# EAGLE design LTP_M - ISP (EAGLE 4.16)
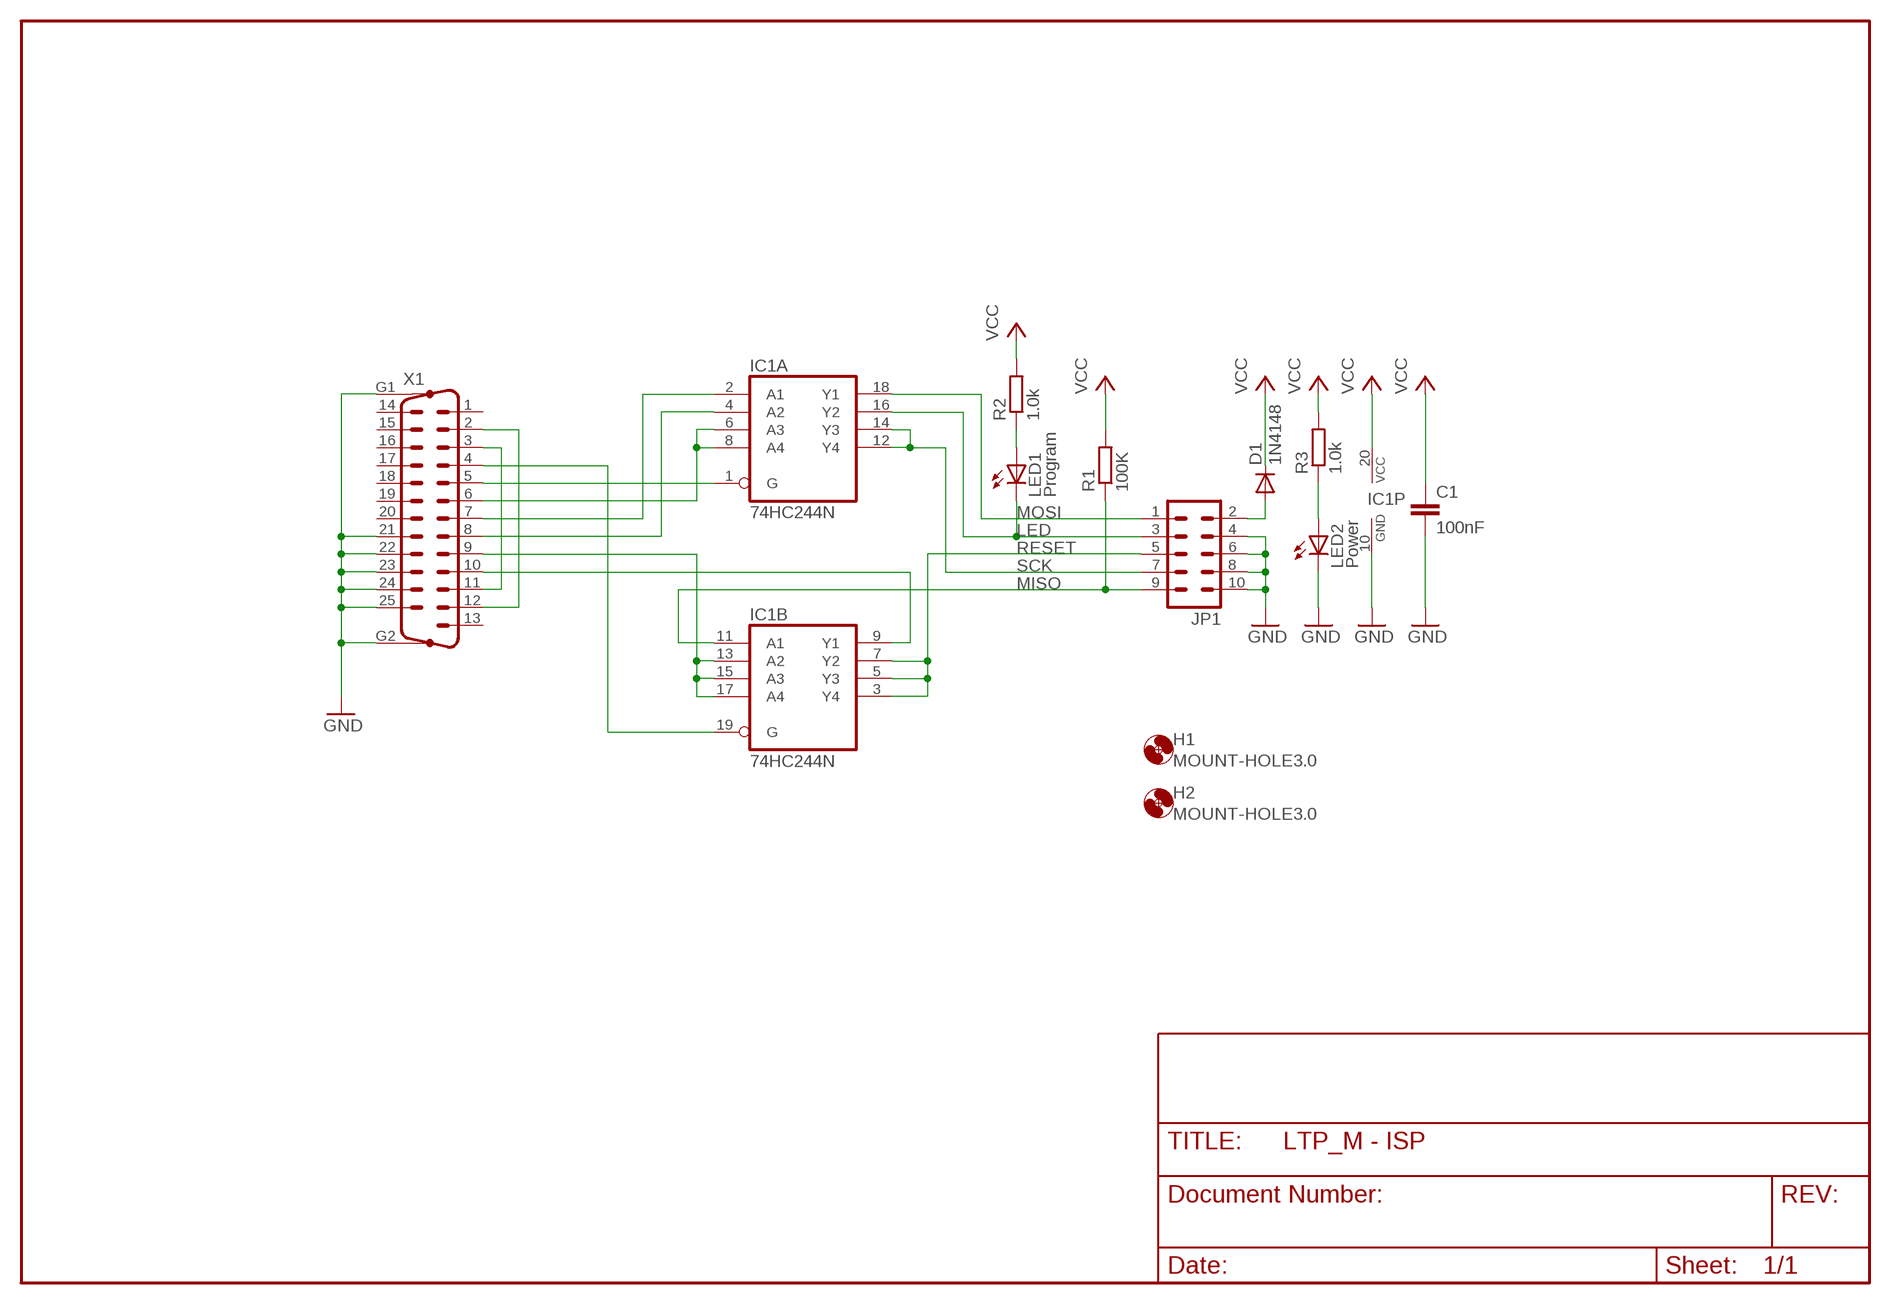
[diagram p0: schematic, sheet 1]

## Parts
C1  100nF  C-EU025-024X044  [C025-024X044]
D1  1N4148  BAS15  [DO34-7]
H1  MOUNT-HOLE3.0  [3,0]
H2  MOUNT-HOLE3.0  [3,0]
IC1  74HC244N  [DIL20]
JP1  ML10  [ML10]
LED1  Program  LED3MM  [LED3MM]
LED2  Power  LED3MM  [LED3MM]
R1  100K  R-EU_0207/7  [0207/7]
R2  1.0k  R-EU_0207/10  [0207/10]
R3  1.0k  R-EU_0207/10  [0207/10]
X1  M25HP  [M25HP]

## Nets
GND: C1.2 IC1.10(P:GND) JP1.4 JP1.6 JP1.8 JP1.10 LED2.K(C) X1.21 X1.22 X1.23 X1.24 X1.25 X1.G1 X1.G2
LED: IC1.16(A:Y2) JP1.3 LED1.K(C)
MISO: IC1.11(B:A1) JP1.9 R1.1
MOSI: IC1.18(A:Y1) JP1.1
N$1: IC1.1(A:G) X1.5
N$2: IC1.19(B:G) X1.4
N$3: X1.2 X1.12
N$4: IC1.2(A:A1) X1.7
N$5: IC1.4(A:A2) X1.8
N$6: IC1.6(A:A3) IC1.8(A:A4) X1.6
N$7: IC1.9(B:Y1) X1.10
N$8: IC1.13(B:A2) IC1.15(B:A3) IC1.17(B:A4) X1.9
N$9: X1.3 X1.11
N$10: LED1.A R2.1
N$11: LED2.A R3.1
RESET: IC1.3(B:Y4) IC1.5(B:Y3) IC1.7(B:Y2) JP1.5
SCK: IC1.12(A:Y4) IC1.14(A:Y3) JP1.7
VCC: C1.1 D1.C IC1.20(P:VCC) R1.2 R2.2 R3.2
VDD: D1.A JP1.2
Unconnected: X1.1 X1.13 X1.14 X1.15 X1.16 X1.17 X1.18 X1.19 X1.20

## Library data of the parts
C1 = rcl:C-EU: CAPACITOR, European symbol
D1 = diode:BAS15: DIODE high speed
H1 H2 = holes:MOUNT-HOLE: MOUNTING HOLE with drill center marker
IC1 = 74xx-eu:74*244: Octal BUFFER and LINE DRIVER, 3-state
JP1 = con-harting-ml:ML10: HARTING
LED1 LED2 = led:LED: LED OSRAM: - CHIPLED LG R971, LG N971, LY N971, LG Q971, LY Q971, LO R971, LY R971 LH N974, LH R974 LS Q976, LO Q976, LY Q976 LO Q996 - Hyper CHIPLED LW Q18S LB Q993, LB Q99A, LB R99A - SideLED LS A670, LO A670, LY A670, LG A670, LP A670 LB A673, LV A673, LT A673, LW A673 LH A674 LY A675 LS A676, LA A676, LO A676, LY A676, LW A676 LS A679, LY A679, LG A679 - Hyper Micro SIDELED® LS Y876, LA Y876, LO Y876, LY Y876 LT Y87S - SmartLED LW L88C, LW L88S LB L89C, LB L89S, LG L890 LS L89K, LO L89K, LY L89K LS L896, LA L896, LO L896, LY L896 - TOPLED LS T670, LO T670, LY T670, LG T670, LP T670 LSG T670, LSP T670, LSY T670, LOP T670, LYG T670 LG T671, LOG T671, LSG T671 LB T673, LV T673, LT T673, LW T673 LH T674 LS T676, LA T676, LO T676, LY T676, LB T676, LH T676, LSB T676, LW T676 LB T67C, LV T67C, LT T67C, LS T67K, LO T67K, LY T67K, LW E67C LS E67B, LA E67B, LO E67B, LY E67B, LB E67C, LV E67C, LT E67C LW T67C LS T679, LY T679, LG T679 LS T770, LO T770, LY T770, LG T770, LP T770 LB T773, LV T773, LT T773, LW T773 LH T774 LS E675, LA E675, LY E675, LS T675 LS T776, LA T776, LO T776, LY T776, LB T776 LHGB T686 LT T68C, LB T68C - Hyper Mini TOPLED® LB M676 - Mini TOPLED Santana® LG M470 LS M47K, LO M47K, LY M47K Source: http://www.osram.convergy.de/
R1-R3 = rcl:R-EU_: RESISTOR, European symbol
X1 = con-subd:M25HP: SUB-D

## Board
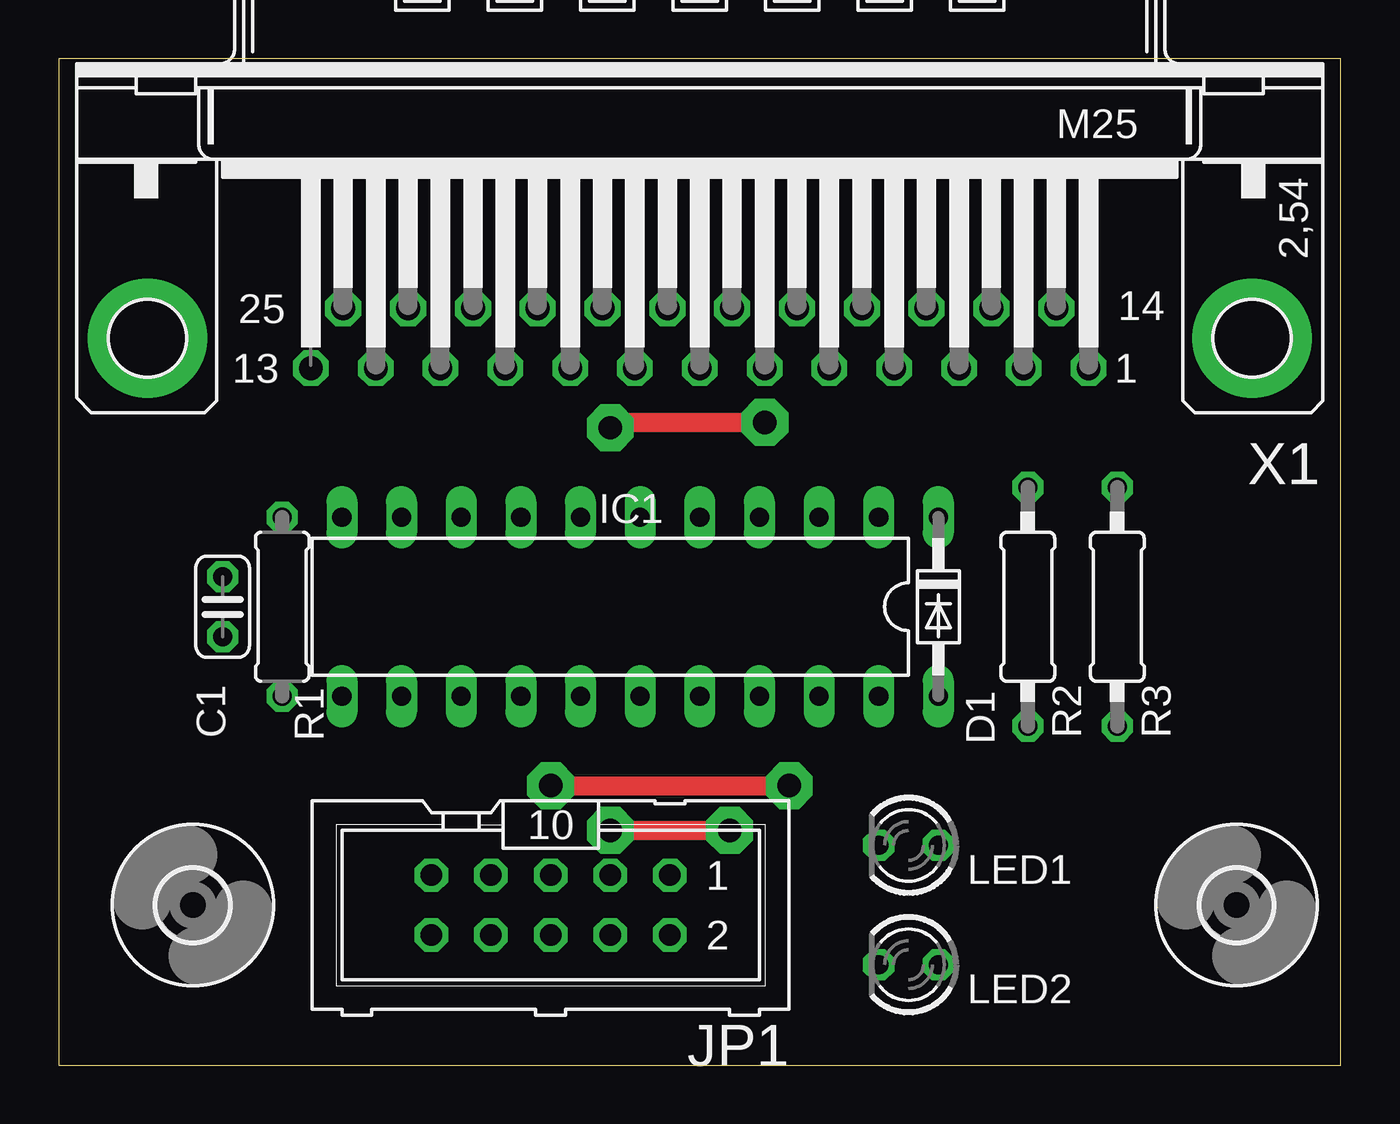
[diagram p1: board, top side]
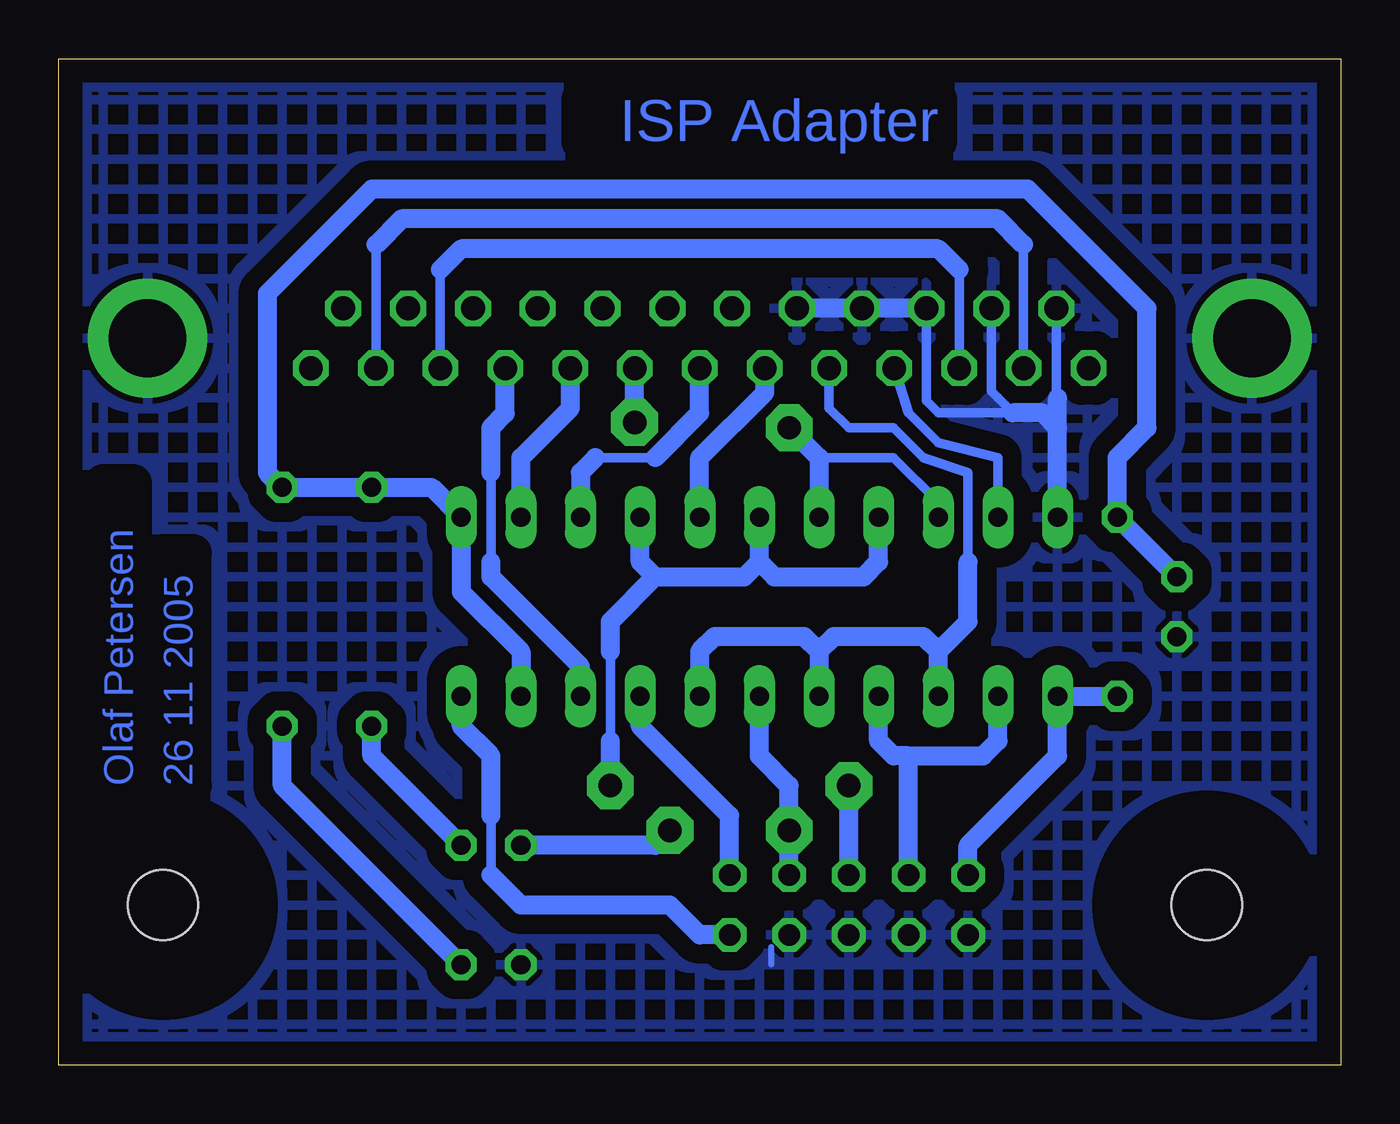
[diagram p2: board, bottom side, seen from below]

Size 54.6 x 42.85 mm. Coordinates in mm from the lower left corner, seen from the top.
Outline: 0,42.85 0,0 54.6,0 54.6,42.85 0,42.85
Copper layers (1*16): Top 0.035mm / dielectric 1.5mm / Bottom 0.035mm
Design rules "default": minimum track width 10mil, minimum drill 40mil, track to track 8mil, track to pad 8mil, pad to pad 8mil, via to via 8mil, smd to smd 8mil, copper to edge 40mil, drill to drill 8mil, minimum pad ring 10mil, minimum via ring 8mil, stop-mask expansion 4mil, vias tented up to drill 0mil, thermal gap 10mil

### Footprints (pad centres in the part's own frame; a part is rotated, then mirrored left to right if it is on the bottom)
C025-024X044 = drill 0.813 octagon: 1 -1.27,0; 2 1.27,0
DO34-7 = drill 0.813 long: A 3.81,0; C -3.81,0
3,0 = hole 3: 0,0
DIL20 = drill 0.813 long: 1 -11.43,-3.81; 2 -8.89,-3.81; 3 -6.35,-3.81; 4 -3.81,-3.81; 5 -1.27,-3.81; 6 1.27,-3.81; 7 3.81,-3.81; 8 6.35,-3.81; 9 8.89,-3.81; 10 11.43,-3.81; 11 11.43,3.81; 12 8.89,3.81; 13 6.35,3.81; 14 3.81,3.81; 15 1.27,3.81; 16 -1.27,3.81; 17 -3.81,3.81; 18 -6.35,3.81; 19 -8.89,3.81; 20 -11.43,3.81
ML10 = drill 0.914 octagon: 1 -5.08,-1.27; 2 -5.08,1.27; 3 -2.54,-1.27; 4 -2.54,1.27; 5 0,-1.27; 6 0,1.27; 7 2.54,-1.27; 8 2.54,1.27; 9 5.08,-1.27; 10 5.08,1.27
LED3MM = drill 0.813 octagon: A -1.27,0; K 1.27,0
0207/7 = drill 0.813 octagon: 1 -3.81,0; 2 3.81,0
0207/10 = drill 0.813 octagon: 1 -5.08,0; 2 5.08,0
M25HP = drill 1.016 octagon: 1 -16.561,1.27; 2 -13.792,1.27; 3 -11.049,1.27; 4 -8.28,1.27; 5 -5.512,1.27; 6 -2.769,1.27; 7 0,1.27; 8 2.769,1.27; 9 5.512,1.27; 10 8.28,1.27; 11 11.049,1.27; 12 13.792,1.27; 13 16.561,1.27; 14 -15.189,-1.27; 15 -12.421,-1.27; 16 -9.652,-1.27; 17 -6.909,-1.27; 18 -4.14,-1.27; 19 -1.372,-1.27; 20 1.372,-1.27; 21 4.14,-1.27; 22 6.909,-1.27; 23 9.652,-1.27; 24 12.421,-1.27; 25 15.189,-1.27 | drill 3.302 pad 5.08 round: G1 -23.52,0; G2 23.52,0

### Placement (x,y rotation side)
C1  6.98,19.52 270 top
D1  37.46,19.52 270 top
H1  50.16,6.82 270 top
H2  5.71,6.82 270 top
IC1  23.49,19.52 180 top
JP1  20.95,6.82 180 top
LED1  36.19,9.36 180 top
LED2  36.19,4.28 180 top
R1  9.52,19.52 90 top
R2  41.27,19.52 90 top
R3  45.08,19.52 90 top
X1  27.3,30.95 180 top

### Tracks (layer width: path | path; a pad name or v marks a point on that pad's centre or on a via)
GND
  Bottom 0.254: 24.25,4.28 24.25,5.04
  Bottom 0.406: 14.6,28.41 14.28,28.09 | X1.24 14.88,28.69 14.6,28.41 | 14.6,28.41 13.97,27.77 17.14,27.77 17.65,28.28 X1.23 17.65,28.92 | X1.25 12.11,28.46 12.06,28.41
  Bottom 0.813: 12.06,27.14 12.06,28.41 | IC1.10 12.06,27.14 | 13.97,27.77 12.7,27.77 12.06,27.14 | X1.23 X1.22 X1.21
  pour Bottom (isolate 0.813, hatched): 55.24,43.65 -0.64,43.65 -0.64,-0.8 55.24,-0.8
LED  (via drill 1)
  Top 0.813: v23.49,10 v28.57,10
  Bottom 0.813: JP1.3 v23.49,10 23.49,11.9 24.76,13.17 IC1.16 | v28.57,10 29.2,9.36 LED1.K
MISO
  Bottom 0.813: R1.1 IC1.11 12.06,13.17 15.87,9.36 JP1.9
MOSI
  Bottom 0.813: JP1.1 26.03,10.63 29.84,14.44 IC1.18
N$1
  Bottom 0.813: IC1.1 34.92,25.87 32.81,27.98 X1.5
N$2
  Bottom 0.406: 36.19,21.42 36.19,25.23
  Bottom 0.813: 36.19,25.23 36.19,27.14 35.58,27.75 X1.4 | 36.19,21.42 36.19,20.79 32.38,16.98 IC1.19
N$3
  Bottom 0.406: X1.12 13.51,34.94 | 41.09,34.94 X1.2
  Bottom 0.813: 13.51,34.94 14.6,36.03 40,36.03 41.09,34.94
N$4
  Bottom 0.406: 29.2,25.87 31.74,25.87
  Bottom 0.813: 31.74,25.87 32.38,25.23 IC1.2 | X1.7 27.3,27.77 29.2,25.87
N$5
  Bottom 0.813: IC1.4 27.3,25.87 24.53,28.64 X1.8
N$6  (via drill 1)
  Top 0.813: v30.07,27.37 23.72,27.37 v23.49,27.14
  Bottom 0.254: 30.07,28.16 30.09,28.16 v30.07,27.37
  Bottom 0.406: IC1.8 17.14,23.96 19.04,25.87 22.22,25.87
  Bottom 0.813: IC1.6 22.22,25.87 v23.49,27.14 | X1.6 30.07,28.16 30.07,27.55
N$7
  Bottom 0.406: X1.10 18.41,27.77 17.14,26.5 14.6,25.87 IC1.9
N$8
  Bottom 0.406: 15.87,21.42 15.87,25.23 17.77,25.87 19.04,27.14 19.68,27.14 | 19.68,27.14 20.31,27.14 | X1.9 21.79,27.98 20.95,27.14 19.68,27.14
  Bottom 0.813: IC1.13 17.14,17.61 | 17.14,17.61 17.77,18.25 21.58,18.25 22.22,17.61 | 22.22,17.61 IC1.15 | 22.22,17.61 22.86,18.25 26.66,18.25 27.3,17.61 IC1.17 | 15.87,21.42 15.87,18.88 17.14,17.61
N$9
  Bottom 0.406: X1.11 16.25,33.87 | 38.35,33.87 X1.3
  Bottom 0.813: 16.25,33.87 17.14,34.76 37.46,34.76 38.35,33.87
N$10
  Bottom 0.813: R2.1 41.27,13.17 LED1.A
N$11
  Bottom 0.813: R3.1 45.08,11.9 LED2.A
RESET  (via drill 1)
  Top 0.813: v20.95,11.9 v31.11,11.9
  Bottom 0.406: 31.11,13.81 31.11,17.61
  Bottom 0.813: 24.76,21.42 25.39,20.79 29.2,20.79 | 29.2,20.79 29.84,21.42 IC1.3 | 31.11,17.61 31.11,18.88 29.2,20.79 | v31.11,11.9 31.11,13.81 | JP1.5 v20.95,11.9 | 24.76,21.42 IC1.5 | 24.76,21.42 24.12,20.79 20.31,20.79 19.68,21.42 IC1.7
SCK
  Bottom 0.813: IC1.12 14.6,13.81 15.24,13.17 18.41,13.17 | 18.41,13.17 19.04,13.17 19.68,13.81 IC1.14 | JP1.7 18.41,13.17
VCC
  Bottom 0.813: C1.1 R1.2 9.52,25.87 8.25,27.14 8.25,32.22 13.33,37.3 41.27,37.3 45.72,32.85 45.72,25.23 R3.2 R2.2 38.73,24.6 D1.C 37.46,20.15 34.92,17.61 IC1.20
VDD
  Bottom 0.406: 36.19,8.09 36.19,10.63
  Bottom 0.813: D1.A 37.46,14.44 36.19,13.17 36.19,10.63 | 36.19,8.09 34.92,6.82 28.57,6.82 27.3,5.55 JP1.2

### Text on the board
Bottom: ISP Adapter | 26 11 2005 | Olaf Petersen